# EAGLE design Board (EAGLE 9.3.0)
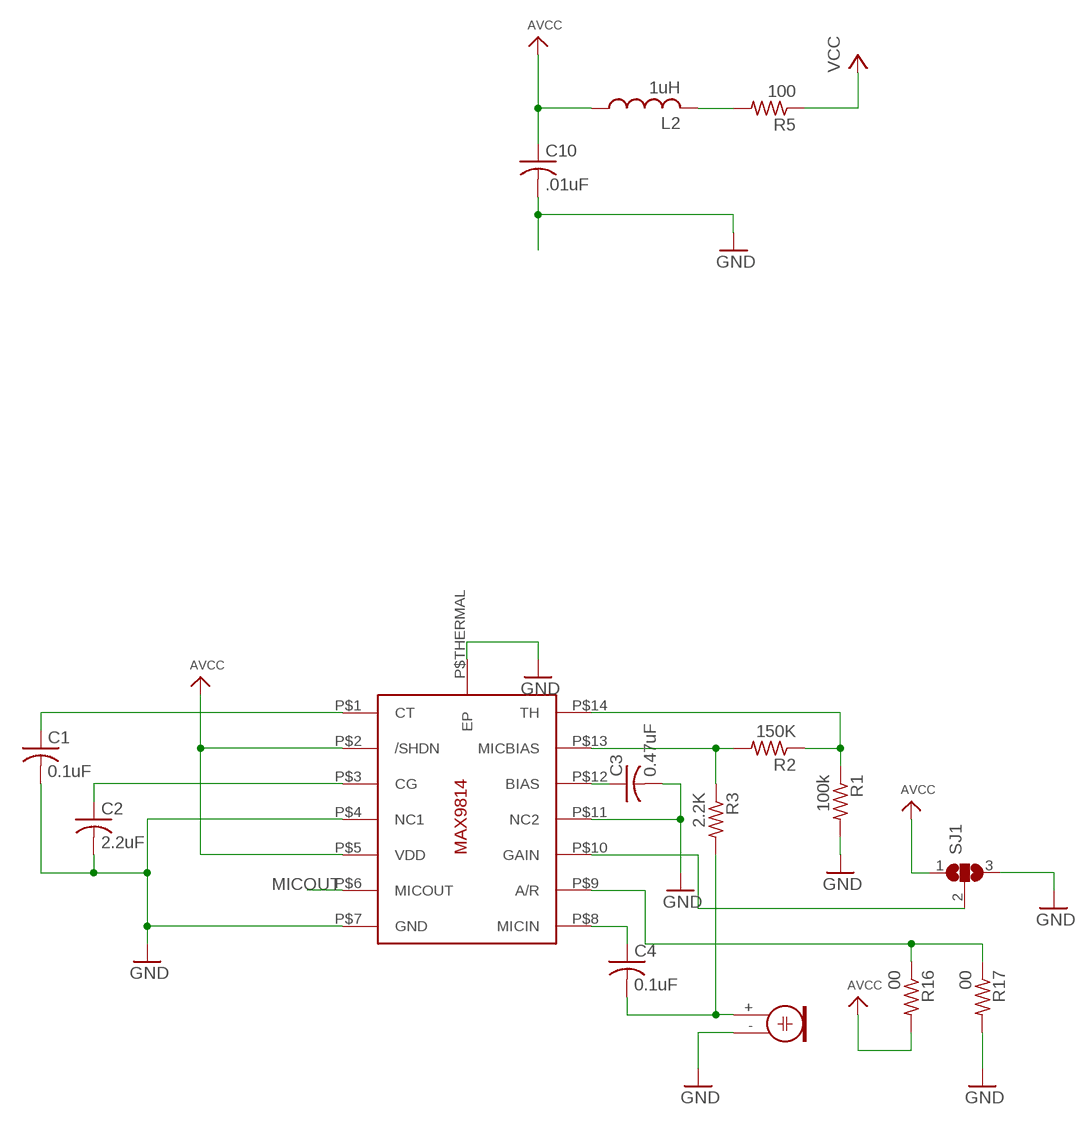
[diagram p0: schematic, sheet 1, part 1 of 2]
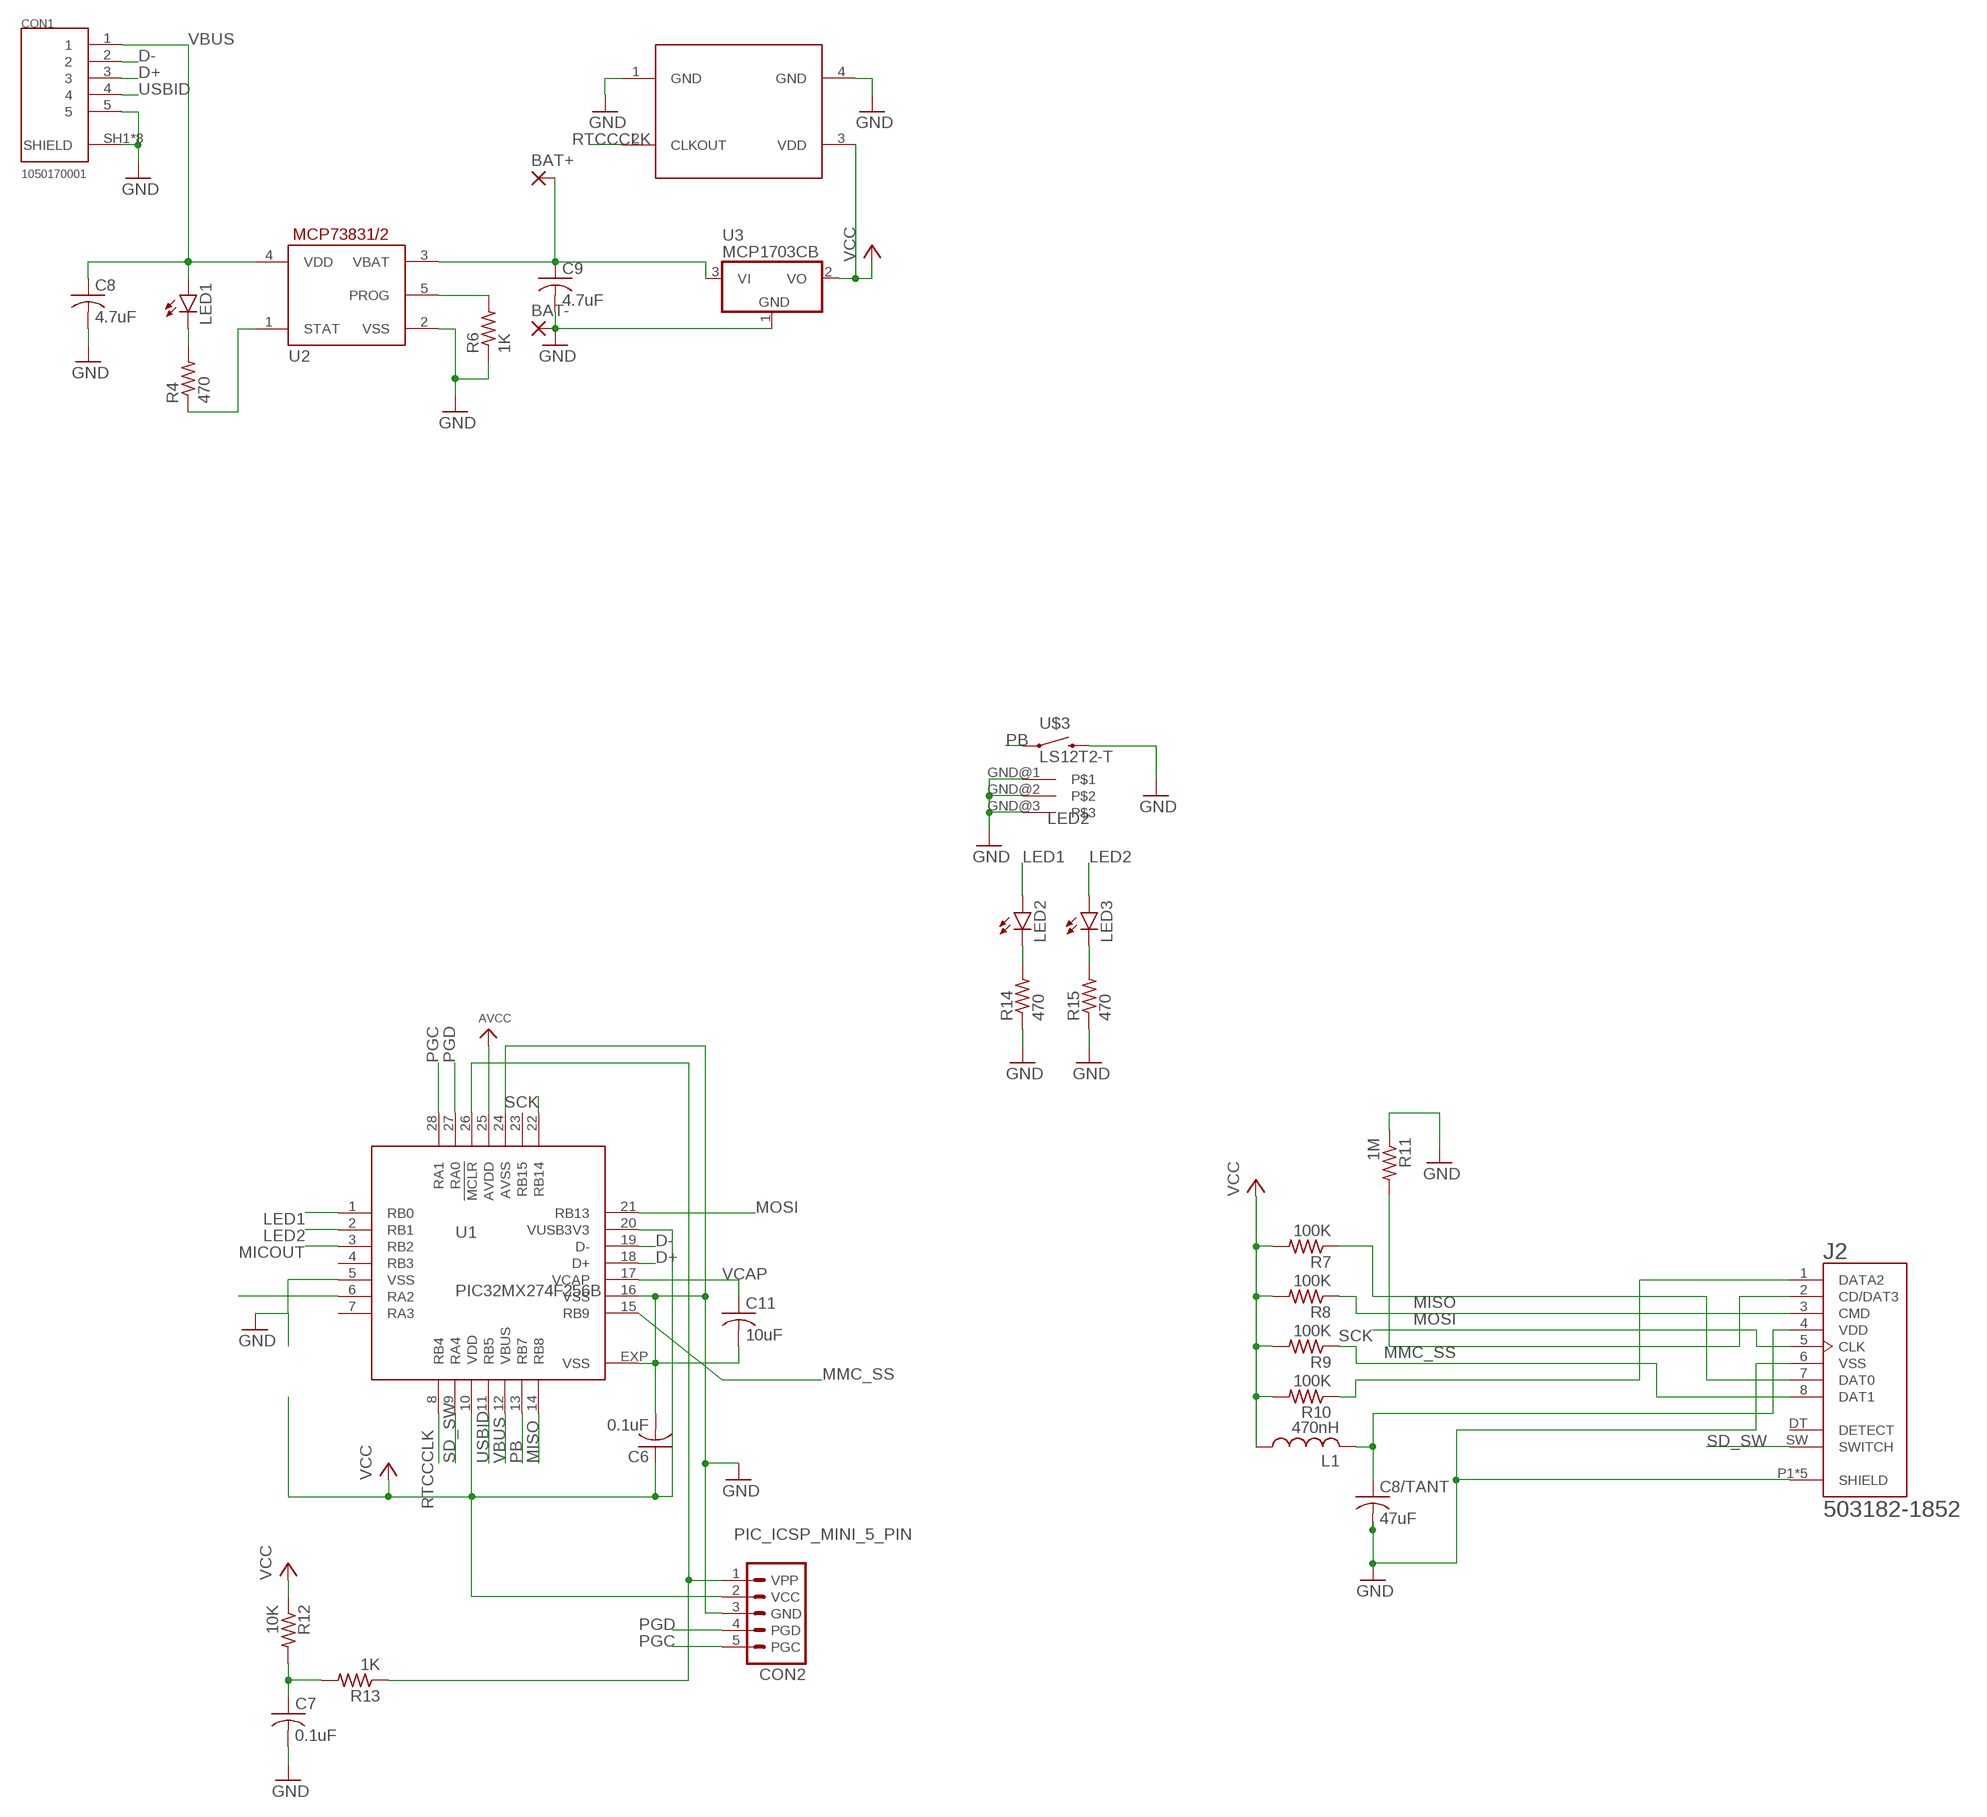
[diagram p1: schematic, sheet 1, part 2 of 2]

## Parts
BAT+  SMD2  [SMD1,27-2,54]
BAT-  SMD2  [SMD1,27-2,54]
C1  0.1uF  C-USC0603  [C0603]
C2  2.2uF  C-USC0603  [C0603]
C3  0.47uF  C-USC0603  [C0603]
C4  0.1uF  C-USC0603  [C0603]
C6  0.1uF  C-USC0603  [C0603]
C7  0.1uF  C-USC0603  [C0603]
C8  4.7uF  C-USC0603  [C0603]
C8/TANT  47uF  C-USC0805  [C0805]
C9  4.7uF  C-USC0603  [C0603]
C10  .01uF  C-USC0603  [C0603]
C11  10uF  C-USC0603  [C0603]
CON1  1050170001  [MOLEX_1050170001]
CON2  PIC_ICSP_MINI_5_PIN  [PIC_ICSP_MINI_5_PIN]
J2  503182-1852  [MOLEX_503182-1852]
L1  470nH  L-USL2012C  [L2012C]
L2  1uH  L-USL2012C  [L2012C]
LED1  LEDCHIP-LED0805  [CHIP-LED0805]
LED2  LEDCHIP-LED0805  [CHIP-LED0805]
LED3  LEDCHIP-LED0805  [CHIP-LED0805]
MIC  ELECTRET  [9.7ELECTRET]
R1  100k  R-US_R0603  [R0603]
R2  150K  R-US_R0603  [R0603]
R3  2.2K  R-US_R0603  [R0603]
R4  470  R-US_R0603  [R0603]
R5  100  R-US_R0603  [R0603]
R6  1K  R-US_R0603  [R0603]
R7  100K  R-US_R0603  [R0603]
R8  100K  R-US_R0603  [R0603]
R9  100K  R-US_R0603  [R0603]
R10  100K  R-US_R0603  [R0603]
R11  1M  R-US_R0603  [R0603]
R12  10K  R-US_R0603  [R0603]
R13  1K  R-US_R0603  [R0603]
R14  470  R-US_R0603  [R0603]
R15  470  R-US_R0603  [R0603]
R16  00  R-US_R0603  [R0603]
R17  00  R-US_R0603  [R0603]
SJ1  SJ2WJUMPER  [C0R-JMP]
U1  PIC32MX274F256B  [QFN28-ML_6X6MM]
U2  MCP73831/OT  [SOT23-5L]
U3  MCP1703CB  [SOT23]
U4  MAX9814TDFN14  [TDFN14_3X3MM]
U$3  LS12T2-T  [LS12T2-T]
X1  SIT1532AC-J5-DCC  [4-UFBGA]

## Nets
AVCC: C10.1 L2.1 R16.2 SJ1.1 U1.25(AVDD) U4.P$2(/SHDN) U4.P$5(VDD)
D+: CON1.3 U1.18(D+)
D-: CON1.2 U1.19(D-)
GND: BAT-.1(P) C1.2 C2.2 C3.2 C6.2 C7.2 C8.2 C8/TANT.2 C9.2 C10.2 C11.2 CON1.5 CON1.SH1(SHIELD) CON1.SH2(SHIELD) CON1.SH3(SHIELD) CON1.SH4(SHIELD) CON1.SH5(SHIELD) CON1.SH6(SHIELD) CON1.SH7(SHIELD) CON1.SH8(SHIELD) CON2.3(GND) J2.6(VSS) J2.P1(SHIELD) J2.P2(SHIELD) J2.P3(SHIELD) J2.P4(SHIELD) J2.P5(SHIELD) MIC.- R1.2 R6.1 R11.1 R14.1 R15.1 R17.2 SJ1.3 U1.5(VSS) U1.16(VSS) U1.24(AVSS) U1.EXP(VSS) U2.2(VSS) U3.1(GND) U4.P$4(NC1) U4.P$7(GND) U4.P$11(NC2) U4.P$THERMAL(EP) U$3.GND@1 U$3.GND@2 U$3.GND@3 U$3.S2 X1.1(GND) X1.4(GND)
LED1: LED2.A U1.1(RB0)
LED2: LED3.A U1.2(RB1)
MICOUT: U1.3(RB2) U4.P$6(MICOUT)
MISO: J2.7(DAT0) R7.1 U1.14(RB8)
MMC_SS: J2.2(CD/DAT3) R11.2 U1.15(RB9)
MOSI: J2.3(CMD) R8.1 U1.21(RB13)
N$1: C1.1 U4.P$1(CT)
N$2: C2.1 U4.P$3(CG)
N$3: R2.2 R3.1 U4.P$13(MICBIAS)
N$4: R16.1 R17.1 U4.P$9(A/R)
N$5: J2.1(DATA2) R10.1
N$6: R1.1 R2.1 U4.P$14(TH)
N$7: J2.8(DAT1) R9.1
N$8: C4.2 MIC.+ R3.2
N$9: LED1.C R4.2
N$10: R4.1 U2.1(STAT)
N$11: C7.1 R12.2 R13.2
N$12: R6.2 U2.5(PROG)
N$13: CON2.1(VPP) R13.1 U1.26(!MCLR)
N$14: U1.6(RA2)
N$16: C3.1 U4.P$12(BIAS)
N$17: BAT+.1(P) C9.1 U2.3(VBAT) U3.3(VI)
N$18: LED2.C R14.2
N$19: LED3.C R15.2
N$20: C8/TANT.1 J2.4(VDD) L1.2
N$21: C4.1 U4.P$8(MICIN)
N$22: L2.2 R5.2
N$23: SJ1.2 U4.P$10(GAIN)
PB: U1.13(RB7) U$3.S1
PGC: CON2.5(PGC) U1.28(RA1)
PGD: CON2.4(PGD) U1.27(RA0)
RTCCCLK: U1.8(RB4) X1.2(CLKOUT)
SCK: J2.5(CLK) U1.22(RB14)
SD_SW: J2.SW(SWITCH) U1.9(RA4)
USBID: CON1.4 U1.11(RB5)
VBUS: C8.1 CON1.1 LED1.A U1.12(VBUS) U2.4(VDD)
VCAP: C11.1 U1.17(VCAP)
VCC: C6.1 CON2.2(VCC) L1.1 R5.1 R7.2 R8.2 R9.2 R10.2 R12.1 U1.10(VDD) U1.20(VUSB3V3) U3.2(VO) X1.3(VDD)
Unconnected: J2.DT(DETECT) U1.4(RB3) U1.7(RA3) U1.23(RB15)

## Library data of the parts
BAT+ BAT- = wirepad:SMD2: SMD PAD
C1-C4 C6-C11 = resistor:C-US: CAPACITOR, American symbol
C8/TANT = rcl:C-US: CAPACITOR, American symbol; SPICEPREFIX: C
CON1 = 1050170001:1050170001: Conn.; Data; USB; Recept.; Micro; B Type; Bottom Mount, SMT, with Solder Tabs, Lead-Free; DESCRIPTION: Conn.; Data; USB; Recept.; Micro; B Type; Bottom Mount, SMT, with Solder Tabs, Lead-Free; DIGI-KEY_PART_NUMBER: WM1399CT-ND; DIGI-KEY_PURCHASE_URL: https://www.digikey.com/product-detail/en/molex-llc/1050170001/WM1399CT-ND/2350885?utm_source=snapeda&utm_medium=aggregator&utm_campaign=symbol; MF: Molex, LLC; MP: 1050170001; PACKAGE: None
CON2 = SparkFun-Connectors:PIC_ICSP_MINI_5_PIN: PIC-ICSP-Mini Miniature 5-pin connection for temporary programming of PICs. Use this device in your design to save space. Miniature ISCP Programming connector for PICs This 5 pin header contains all the lines necessary for programming most PIC microcontrollers. Use this device in your design to save space. Here is the connector we sell at SparkFun: 5-Pin Mini ICSP Connector <https://www.sparkfun.com/products/11264> (PRT-11264) It is used on these SparkFun products: USB Bit Whacker - 18F2553 Development Board <https://www.sparkfun.com/products/762> (DEV-00762) SparkFun Serial Enabled LCD Backpack <https://www.sparkfun.com/products/258> (LCD-00258) Also, if you need a nice PIC programmer, please check these out: MPLAB PICkit 3 <https://www.sparkfun.com/products/9973> (PGM-09973); PROD_ID: CONN-08314; SF_ID: PRT-11264
J2 = 503182-1852:503182-1852: Conn Micro SD Card M 8 POS 1.09mm Solder RA SMD Embossed T/R 0.5A/Contact; DESCRIPTION: MICRO SD NORMAL ULTRALOWPRO8CKTE; DIGI-KEY_PART_NUMBER: WM12834CT-ND; DIGI-KEY_PURCHASE_URL: https://www.digikey.com/product-detail/en/molex-llc/5031821852/WM12834CT-ND/5823232?utm_source=snapeda&utm_medium=aggregator&utm_campaign=symbol; MF: Molex, LLC; MP: 5031821852; PACKAGE: None
L1 L2 = resistor:L-US: INDUCTOR, American symbol
LED1-LED3 = led:LED: LED OSRAM: - CHIPLED LG R971, LG N971, LY N971, LG Q971, LY Q971, LO R971, LY R971 LH N974, LH R974 LS Q976, LO Q976, LY Q976 LO Q996 - Hyper CHIPLED LW Q18S LB Q993, LB Q99A, LB R99A - SideLED LS A670, LO A670, LY A670, LG A670, LP A670 LB A673, LV A673, LT A673, LW A673 LH A674 LY A675 LS A676, LA A676, LO A676, LY A676, LW A676 LS A679, LY A679, LG A679 - Hyper Micro SIDELED® LS Y876, LA Y876, LO Y876, LY Y876 LT Y87S - SmartLED LW L88C, LW L88S LB L89C, LB L89S, LG L890 LS L89K, LO L89K, LY L89K LS L896, LA L896, LO L896, LY L896 - TOPLED LS T670, LO T670, LY T670, LG T670, LP T670 LSG T670, LSP T670, LSY T670, LOP T670, LYG T670 LG T671, LOG T671, LSG T671 LB T673, LV T673, LT T673, LW T673 LH T674 LS T676, LA T676, LO T676, LY T676, LB T676, LH T676, LSB T676, LW T676 LB T67C, LV T67C, LT T67C, LS T67K, LO T67K, LY T67K, LW E67C LS E67B, LA E67B, LO E67B, LY E67B, LB E67C, LV E67C, LT E67C LW T67C LS T679, LY T679, LG T679 LS T770, LO T770, LY T770, LG T770, LP T770 LB T773, LV T773, LT T773, LW T773 LH T774 LS E675, LA E675, LY E675, LS T675 LS T776, LA T776, LO T776, LY T776, LB T776 LHGB T686 LT T68C, LB T68C - Hyper Mini TOPLED® LB M676 - Mini TOPLED Santana® LG M470 LS M47K, LO M47K, LY M47K Source: http://www.osram.convergy.de LUXEON: - LUMILED® LXK2-PW12-R00, LXK2-PW12-S00, LXK2-PW14-U00, LXK2-PW14-V00 LXK2-PM12-R00, LXK2-PM12-S00, LXK2-PM14-U00 LXK2-PE12-Q00, LXK2-PE12-R00, LXK2-PE12-S00, LXK2-PE14-T00, LXK2-PE14-U00 LXK2-PB12-K00, LXK2-PB12-L00, LXK2-PB12-M00, LXK2-PB14-N00, LXK2-PB14-P00, LXK2-PB14-Q00 LXK2-PR12-L00, LXK2-PR12-M00, LXK2-PR14-Q00, LXK2-PR14-R00 LXK2-PD12-Q00, LXK2-PD12-R00, LXK2-PD12-S00 LXK2-PH12-R00, LXK2-PH12-S00 LXK2-PL12-P00, LXK2-PL12-Q00, LXK2-PL12-R00 Source: www.luxeon.com KINGBRIGHT: KA-3528ASYC Source: www.kingbright.com
MIC = Extras:ELECTRET: Electret microphone Thru hole 2.54mm spacing with 9.7mm diameter
R1-R17 = resistor:R-US_: RESISTOR, American symbol
SJ1 = Extras:SJ2W: SMD solder JUMPER
U1 = Extras:PIC32MX274F256B
U2 = adafruit:MCP73831: MCP73831/2 Miniature Single-Cell, Fully Integrated Li-Ion, Li-Polymer Charge Management Controllers. Nice and small simple lipoly charge controller, with adjustable current and status output (LED) http://www.ladyada.net/library/pcb/eaglelibrary.html
U3 = linear:MCP1703: 250 mA, 16V, Low Quiescent Current LDO Regulator Source: http://ww1.microchip.com/downloads/en/DeviceDoc/22049b.pdf
U4 = adafruit:MAX9814
U$3 = Extras:LS12T2-T
X1 = Extras:SIT1532AC-J5-DCC

## Board
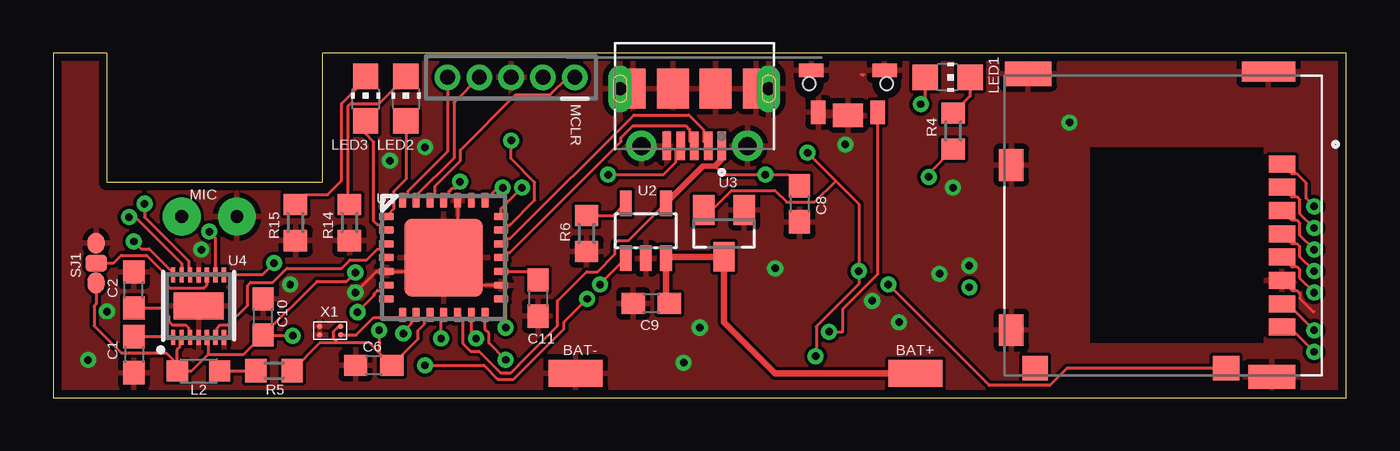
[diagram p2: board, top side]
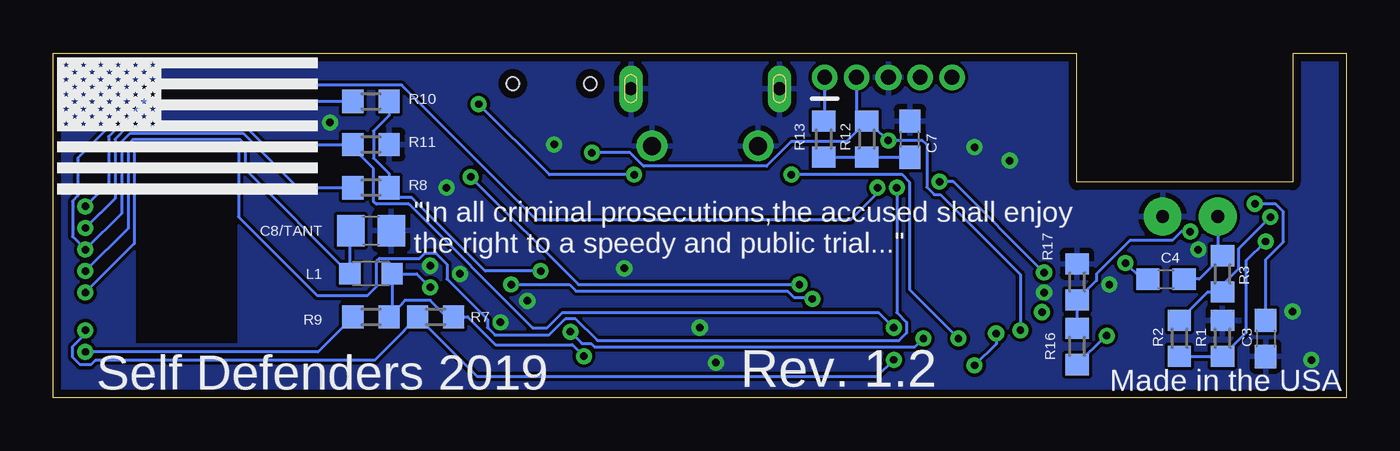
[diagram p3: board, bottom side, seen from below]

Size 60.96 x 16.26 mm. Coordinates in mm from the lower left corner, seen from the top.
Outline: 0,0 60.96,0 60.96,16.26 12.7,16.26 12.7,10.16 2.54,10.16 2.54,16.26 0,16.26 0,0
Copper layers (1*16): Top 0.035mm / dielectric 1.5mm / Bottom 0.035mm
Design rules "default *": minimum track width 6mil, minimum drill 0.35mm, track to track 6mil, track to pad 6mil, pad to pad 6mil, via to via 6mil, smd to smd 6mil, copper to edge 15mil, drill to drill 4mil, minimum pad ring 10mil, minimum via ring 8mil, stop-mask expansion 2mil, vias tented up to drill 0mil, thermal gap 10mil

### Footprints (pad centres in the part's own frame; a part is rotated, then mirrored left to right if it is on the bottom)
SMD1,27-2,54 = smd 1.27 x 2.54: 1 0,0
C0603 = smd 1.1 x 1: 1 -0.85,0; 2 0.85,0
C0805 = smd 1.3 x 1.5: 1 -0.95,0; 2 0.95,0
MOLEX_1050170001 = smd 0.4 x 1.35: 1 -1.3,2.35; 2 -0.65,2.35; 3 0,2.35; 4 0.65,2.35; 5 1.3,2.35 | drill 0.85 pad 1.45: SH1 -2.5,2.35; SH2 2.5,2.35 | drill 0.6 pad 0.95 long: SH3 -3.5,-0.35; SH8 3.5,-0.35 | smd 1.2 x 1.9: SH4 -2.9,-0.35; SH7 2.9,-0.35 | smd 1.5 x 1.9: SH5 -1,-0.35; SH6 1,-0.35
PIC_ICSP_MINI_5_PIN = drill 0.7: 1 -3,0; 2 -1.5,0; 3 0,0; 4 1.5,0; 5 3,0
MOLEX_503182-1852 = smd 0.8 x 1.24: 1 -2.9,6.355; 2 -1.8,6.355; 3 -0.7,6.355; 4 0.4,6.355; 5 1.5,6.355; 6 2.6,6.355; 7 3.7,6.355; 8 4.8,6.355 | smd 1.16 x 1.2: DT 6.74,-5.275 | smd 0.95 x 2.5: P1 -7.245,5.725 | smd 1.15 x 2.2: P2 7.145,5.875; P3 -7.145,-5.605 | smd 1.5 x 1.15: P4 -2.84,-6.4; P5 4.94,-6.4 | smd 1.16 x 1.25: SW 6.74,3.725
L2012C = smd 1 x 1: 1 -1,0; 2 1,0
CHIP-LED0805 = smd 1.2 x 1.2: A 0,-1.05; C 0,1.05
9.7ELECTRET = drill 0.6 pad 1.778: + 1.3,2; - -1.3,2
R0603 = smd 1 x 1.1: 1 -0.85,0; 2 0.85,0
C0R-JMP = smd 0.8 x 1: 1 0,0.938; 3 0,-0.938 | smd 1 x 0.8: 2 0,0
QFN28-ML_6X6MM = smd 0.7 x 0.35: 1 -2.7,1.95; 2 -2.7,1.3; 3 -2.7,0.65; 4 -2.7,0; 5 -2.7,-0.65; 6 -2.7,-1.3; 7 -2.7,-1.95; 15 2.7,-1.95; 16 2.7,-1.3; 17 2.7,-0.65; 18 2.7,0; 19 2.7,0.65; 20 2.7,1.3; 21 2.7,1.95 | smd 0.35 x 0.7: 8 -1.95,-2.7; 9 -1.3,-2.7; 10 -0.65,-2.7; 11 0,-2.7; 12 0.65,-2.7; 13 1.3,-2.7; 14 1.95,-2.7; 22 1.95,2.7; 23 1.3,2.7; 24 0.65,2.7; 25 0,2.7; 26 -0.65,2.7; 27 -1.3,2.7; 28 -1.95,2.7 | smd 3.7 x 3.7: EXP 0,0
SOT23-5L = smd 0.55 x 1.2: 1 -0.95,-1.3; 2 0,-1.3; 3 0.95,-1.3; 4 0.95,1.3; 5 -0.95,1.3
SOT23 = smd 1 x 1.4: 1 -0.95,-1.1; 2 0.95,-1.1; 3 0,1.1
TDFN14_3X3MM = smd 0.7 x 0.2: P$1 -1.475,1.2; P$2 -1.475,0.8; P$3 -1.475,0.4; P$4 -1.475,0; P$5 -1.475,-0.4; P$6 -1.475,-0.8; P$7 -1.475,-1.2; P$8 1.475,-1.2; P$9 1.475,-0.8; P$10 1.475,-0.4; P$11 1.475,0; P$12 1.475,0.4; P$13 1.475,0.8; P$14 1.475,1.2 | smd 1.27 x 2.35: P$THERMAL 0,0
LS12T2-T = smd 1.1 x 1.4: GND@1 -0.15,0 | smd 0.65 x 1.15: GND@2 1.975,-1.725; GND@3 1.975,1.725 | smd 1.1 x 0.7: S1 0,-1.4; S2 0,1.4 | hole 0.6: 1.35,-1.825; 1.35,1.825
4-UFBGA = smd 0.254 x 0.254: 1 -0.22,0.52; 2 -0.22,-0.48; 3 0.19,-0.48; 4 0.19,0.52

### Placement (x,y rotation side)
BAT+  40.64,1.14 90 top
BAT-  24.63,1.14 90 top
C1  3.81,2.03 270 top
C2  3.81,5.08 90 top
C3  3.81,2.79 270 bottom
C4  8.51,5.59 0 bottom
C6  15.11,1.52 180 top
C7  20.57,12.19 90 bottom
C8  35.18,9.14 270 top
C8/TANT  45.97,7.87 0 bottom
C9  28.19,4.45 180 top
C10  9.91,3.81 90 top
C11  22.86,4.7 270 top
CON1  30.23,14.22 180 top
CON2  21.59,15.11 180 top
J2  51.56,8.13 270 top
L1  45.97,5.84 180 bottom
L2  6.86,1.27 0 top
LED1  42.16,15.11 270 top
LED2  16.64,14.1 0 top
LED3  14.73,14.1 0 top
MIC  7.37,10.54 180 top
R1  5.84,2.79 90 bottom
R2  7.87,2.79 90 bottom
R3  5.84,5.84 90 bottom
R4  42.42,12.57 90 top
R5  10.41,1.27 180 top
R6  25.15,7.75 90 top
R7  42.93,3.81 0 bottom
R8  45.97,9.91 0 bottom
R9  45.97,3.81 0 bottom
R10  45.97,13.97 0 bottom
R11  45.97,11.94 180 bottom
R12  22.61,12.19 270 bottom
R13  24.64,12.19 270 bottom
R14  13.97,8.26 90 top
R15  11.43,8.26 90 top
R16  12.7,2.41 270 bottom
R17  12.7,5.46 90 bottom
SJ1  2.03,6.35 180 top
U1  18.41,6.6 0 top
U2  27.94,7.87 0 top
U3  31.62,7.75 180 top
U4  6.86,4.32 90 top
U$3  37.47,13.46 90 top
X1  13.08,3.17 90 top

### Tracks (layer width: path | path; a pad name or v marks a point on that pad's centre or on a via)
AVCC  (via drill 0.35)
  Top 0.152: L2.1 5.86,2.27 5.99,2.4 5.99,2.77 U4.P$2 | 9.87,2.92 8.99,2.05 7.31,2.05 | 9.87,2.92 C10.1 12.44,5.49 13.84,5.49 v14.25,5.9 | L2.1 6.54,1.27 7.31,2.05 | L2.1 5.86,1.59 5.34,2.1 3.21,2.1 1.93,3.39 1.93,4.32 2.03,4.41 SJ1.1 | U4.P$5 arc-90 7.31,2.79 7.31,2.05 | v19.18,10.19 19.18,10.07 18.99,9.88 18.82,9.88 18.66,9.73 18.66,9.55 U1.25 | v11.3,2.92 9.87,2.92
  Bottom 0.152: R16.2 11.34,2.92 v11.3,2.92 | v14.25,5.9 18.54,10.19 v19.18,10.19
D+
  Top 0.152: U1.18 21.36,6.85 21.54,6.85 26.77,12.08 26.77,12.27 27.33,12.83 29.82,12.83 30,12.64 30,12.1 CON1.3
D-
  Top 0.152: U1.19 21.36,7.5 21.54,7.5 27.37,13.34 29.96,13.34 30.66,12.64 30.66,12.1 CON1.2
GND  (via drill 0.35)
  Top 0.152: U1.24 19.07,7.25 U1.EXP | U1.EXP 17.77,5.95 U1.5 15.25,5.95 v14.25,4.95 | U1.16 19.71,5.3 U1.EXP | 59.44,4.06 59.38,4.06 58.77,4.68 58.77,4.92 58.63,5.06 58.39,5.06 J2.6 | 38.1,15.24 38.21,15.24
  other vias: 17.53,11.81 47.9,12.98 15.88,11.18 11.18,5.33 2.54,4.06 1.65,1.78 41.78,5.84 42.42,9.91 37.34,11.94 43.18,6.22 38.61,4.57 29.72,1.65 30.48,3.3 34.04,6.1 39.88,3.56 6.99,6.99
  pour Top: 0,16.26 2.54,16.26 2.54,10.16 12.7,10.16 12.7,16.26 60.96,16.26 60.96,0 0,0
  pour Bottom: 0,16.26 2.54,16.26 2.54,10.16 12.7,10.16 12.7,16.26 60.96,16.26 60.96,0 0,0
LED1
  Top 0.152: U1.1 16.06,8.9 16.06,9.73 16.64,10.3 LED2.A
LED2
  Top 0.152: U1.2 15.47,8.15 15.29,8.15 15.11,8.33 15.11,12.06 14.73,12.45 LED3.A
MICOUT
  Top 0.152: U4.P$6 7.73,2.91 7.73,3.29 7.86,3.42 8.24,3.42 9.18,4.36 9.18,5.3 9.31,5.44 10.36,5.44 11.02,6.1 13.59,6.1 14,6.5 14.79,6.5 15.29,7.01 15.47,7.01 U1.3
MISO  (via drill 0.35)
  Top 0.152: J2.7 arc90 58.03,4.32 58.29,4.32 v59.44,3.17 | v21.34,1.78 20.55,2.57 20.55,3.04 20.36,3.23 U1.14
  Bottom 0.152: v59.44,3.17 59.44,3.02 60.04,2.41 60.04,1.91 59.69,1.55 59.19,1.55 58.96,1.78 45.78,1.78 44.4,3.17 44.4,3.19 R7.1 40.97,1 22.12,1 v21.34,1.78
MMC_SS  (via drill 0.35)
  Top 0.152: v59.44,8 58.77,8.67 58.77,9.32 58.63,9.46 58.39,9.46 J2.2 | v21.34,3.3 21.34,4.43 U1.15
  Bottom 0.152: 46.99,11.94 51.04,11.94 51.88,12.77 57.46,12.77 58.04,12.19 58.04,9.4 v59.44,8 | 46.99,11.94 R11.2 | 46.99,11.94 45.85,10.8 45.85,9.26 45.72,9.13 44.18,9.13 38.35,3.3 37.67,3.3 36.95,4.02 22.05,4.02 v21.34,3.3
MOSI  (via drill 0.35)
  Top 0.152: U1.21 21.11,8.92 v22.1,9.91 | v59.44,6.99 58.77,7.66 58.77,8.22 58.63,8.36 58.39,8.36 J2.3
  Bottom 0.152: R8.1 49.44,9.91 52,12.47 57.33,12.47 57.73,12.07 57.73,8.69 v59.44,6.99 60.04,7.59 60.04,9.27 59.79,9.52 59.79,11.3 56.34,14.75 44.53,14.75 38.16,8.38 23.37,8.38 22.1,9.65 v22.1,9.91
N$1
  Top 0.152: C1.1 5.62,2.88 U4.P$1
N$2
  Top 0.152: C2.1 5.07,4.23 5.45,3.85 5.45,3.59 5.62,3.42 6.25,3.42 6.39,3.29 6.39,2.91 U4.P$3
N$3  (via drill 0.35)
  Top 0.152: v3.58,8.52 3.88,8.52 6.06,6.34 U4.P$13
  Bottom 0.152: R2.2 6.53,4.99 R3.1 5.84,5.32 5.06,6.1 5.06,7.04 v3.58,8.52
N$4  (via drill 0.35)
  Top 0.152: U4.P$9 7.66,7.54 v7.37,7.83
  Bottom 0.152: v7.37,7.83 7.79,7.83 8.2,7.42 10.2,7.42 11.78,5.84 11.78,5.53 R17.1 R16.1
N$5  (via drill 0.35)
  Top 0.152: v59.44,9.02 59.07,9.38 59.07,10.12 58.63,10.56 58.39,10.56 J2.1
  Bottom 0.152: R10.1 56.69,13.97 58.34,12.32 58.34,10.11 v59.44,9.02
N$6  (via drill 0.35)
  Top 0.152: U4.P$14 5.63,5.82 5.63,5.91 4.53,7.01 4.16,7.01 v3.81,7.37
  Bottom 0.152: R2.1 R1.1 4.72,3.07 4.72,6.46 v3.81,7.37
N$7  (via drill 0.35)
  Top 0.152: v59.44,2.16 58.27,3.33 J2.8
  Bottom 0.152: R9.1 48.48,2.16 v59.44,2.16
N$8
  Bottom 0.152: MIC.+ 6.07,6.92 R3.2 6.95,5.59 C4.2
N$9
  Top 0.152: LED1.C 43.21,14.22 R4.2
N$10  (via drill 0.35)
  Top 0.152: R4.1 41.27,10.58 v41.27,10.41 | v25.78,5.33 25.78,5.37 U2.1
  Bottom 0.152: v41.27,10.41 36.2,5.33 v25.78,5.33
N$11
  Bottom 0.152: R13.2 R12.2 C7.1
N$12
  Top 0.152: R6.2 26.41,8.6 U2.5
N$13
  Top 0.152: U1.26 18.01,9.55 18.01,9.99 19.2,11.18 19.2,11.68 21.8,14.28 23.43,14.28 24.27,15.11 CON2.1
  Bottom 0.152: R13.1 24.59,13.09 CON2.1
N$14  (via drill 0.35)
  Top 0.152: U1.6 15.47,5.06 15.29,5.06 15.14,4.9 15.14,4.82 v14.35,4.03
N$16  (via drill 0.35)
  Top 0.152: v4.32,9.14 4.32,8.51 6.39,6.44 6.39,5.86 U4.P$12
  Bottom 0.152: C3.1 3.81,6.51 2.97,7.34 2.97,8.77 3.33,9.12 4.3,9.12 v4.32,9.14
N$17
  Top 0.305: C9.1 28.89,4.6 U2.3 28.96,6.65 U3.3 31.62,3.56 34.04,1.14 BAT+.1
N$18
  Top 0.152: R14.2 13.9,9.17 13.9,13.74 14.04,13.88 15.37,13.88 LED2.C
N$19
  Top 0.152: R15.2 11.9,9.58 12.94,9.58 13.6,10.23 13.6,13.87 14.73,15 LED3.C
N$20  (via drill 0.35)
  Top 0.152: v59.44,5.97 58.77,6.64 58.77,7.12 58.63,7.26 58.39,7.26 J2.4
  Bottom 0.152: C8/TANT.1 46.97,7.82 L1.2 51.91,10.78 51.91,11.94 52.13,12.16 57.2,12.16 57.43,11.94 57.43,7.98 v59.44,5.97
N$21  (via drill 0.35)
  Top 0.152: v10.41,6.35 9.86,5.79 U4.P$8
  Bottom 0.152: v10.41,6.35 9.65,5.59 C4.1
N$22
  Top 0.152: L2.2 R5.2
N$23
  Top 0.152: SJ1.2 2.86,6.35 3.21,6.71 4.41,6.71 5.33,5.78 5.33,5.35 5.5,5.18 7.11,5.18 7.26,5.33 U4.P$10
PB  (via drill 0.35)
  Top 0.152: v36.58,3.1 37.21,3.1 37.21,4.17 38.87,5.82 U$3.S1 | v19.94,2.79 19.71,3.02 U1.13
  Bottom 0.152: v36.58,3.1 36.03,2.56 35.6,2.56 35.44,2.39 20.34,2.39 v19.94,2.79
PGC
  Top 0.152: U1.28 16.71,9.55 16.71,9.73 18.59,11.61 CON2.5
PGD
  Top 0.152: CON2.4 18.89,13.92 18.89,11.3 17.11,9.52 U1.27
RTCCCLK
  Top 0.152: 13.62,3.01 X1.2 14.29,2.96 15.12,3.78 16.34,3.78 16.43,3.87 U1.8
SCK  (via drill 0.35)
  Top 0.152: v59.44,4.95 58.77,5.62 58.77,6.02 58.63,6.16 58.39,6.16 J2.5 | U1.22 20.97,9.91 v21.19,9.91
  Bottom 0.152: v59.44,4.95 57.12,7.27 57.12,11.81 57.08,11.86 52.26,11.86 52.21,11.81 52.21,8.52 48.51,4.83 46.12,4.83 45.7,5.25 45.7,6.44 45.57,6.57 43.69,6.57 43.43,6.83 42.93,6.83 42.39,6.29 42.39,5.59 40.48,3.69 40.48,3.31 40.13,2.95 37.59,2.95 36.83,3.71 36.33,3.71 35.31,2.69 21.09,2.69 20.73,3.05 20.73,3.55 21.19,4.01 v21.19,9.91
SD_SW  (via drill 0.35)
  Top 0.152: J2.SW 47.79,1.39 46.98,0.58 44.12,0.58 v39.37,5.33 | v16.51,3.02 16.51,3.3 16.54,3.33 16.71,3.33 16.87,3.48 16.87,3.66 U1.9 | v17.53,1.52 20.31,1.52 20.96,0.87 21.71,0.87 24.08,3.24 24.08,3.56 v25.17,4.66
  Bottom 0.152: v39.37,5.33 36.63,5.33 36.32,5.03 26.33,5.03 26.03,4.73 25.25,4.73 v25.17,4.66 | v16.51,3.02 16.51,2.54 v17.53,1.52
USBID  (via drill 0.35)
  Top 0.152: CON1.4 29.36,11.65 29.36,11.1 28.76,10.51 v26.16,10.51 | v18.29,2.79 18.29,3.78 U1.11
  Bottom 0.152: v26.16,10.51 20.94,10.51 20.58,10.16 20.58,5.09 v18.29,2.79
VBUS  (via drill 0.35)
  Top 0.152: v40.89,13.84 41.11,14.06 LED1.A | 31.19,10.92 31.6,10.51 v33.57,10.51 34.66,10.51 C8.1 | U2.4 27.12,7.4 26.62,7.4 26.49,7.27 26.49,6.77 25.66,5.94 25.15,5.94 23.78,4.57 23.78,3.39 21.94,1.56 21.94,1.53 21.59,1.18 21.09,1.18 20.07,2.19 19.69,2.19 19.31,2.56 19.31,3.66 U1.12
  Top 0.254: U2.4 30.64,10.92 31.19,10.92 31.53,11.25 CON1.1
  Bottom 0.152: v33.57,10.51 37.56,10.51 v40.89,13.84
VCAP
  Top 0.152: U1.17 22.45,5.95 C11.1
VCC  (via drill 0.35)
  Top 0.152: v35.56,11.56 36.89,10.22 | 36.89,10.22 37.97,9.14 v37.97,5.97 37.97,5.36 35.97,3.36 35.97,1.98 v35.94,1.95 | U1.10 17.52,3.66 17.52,3.48 17.21,3.17 17.21,2.77 C6.1 15.37,2.12 | U1.20 21.36,8.15 21.54,8.15 22.7,9.32 22.7,10.16 21.59,11.27 v21.59,12.13 | 13.41,2.6 13.21,2.81 13.21,3.1 13.42,3.31 13.51,3.31 X1.3 | R5.1 12.59,2.6 13.41,2.6 | 36.89,10.22 35.88,9.21 34.58,9.21 34.02,9.78 31.98,9.78 31.05,8.85 U3.2 | v15.37,3.17 15.37,2.12 | 15.37,2.12 14.89,2.6 13.41,2.6
  Bottom 0.152: R10.2 45.12,13.31 45.85,12.58 45.85,11.29 45.12,10.56 R8.2 44.65,9.43 44.05,9.43 40.59,5.97 v37.97,5.97 | CON2.2 23.09,13.53 R12.1 | R12.1 23.58,12.07 26.18,12.07 27.33,10.92 33.12,10.92 33.76,11.56 v35.56,11.56 | v15.37,3.17 15.37,5.8 19.14,9.58 19.43,9.58 19.78,9.93 19.78,11.93 19.98,12.12 v21.59,12.13 R12.1 | v43.18,5.21 43.81,5.84 L1.1 44.97,3.96 R9.2 44.51,4.43 44.51,4.46 44.37,4.59 43.18,4.59 42.4,3.81 R7.2 41.42,3.81 40.11,2.5 36.49,2.5 v35.94,1.95

### Text on the board
_tsilk: MCLR
_bsilk: "In all criminal prosecutions,the accused shall enjoy / the right to a speedy and public trial..." | Rev. 1.2 | Made in the USA | Self Defenders 2019